# Altium schematic sheet IMU.SchDoc: IMU
size 431 x 279 mm; Date: 02/15/2021; DrawnBy: Team KOIN; Organization: University of Pennsylvania; DocumentNumber: 7; Revision: 2; SheetNumber: 7; SheetTotal: 8
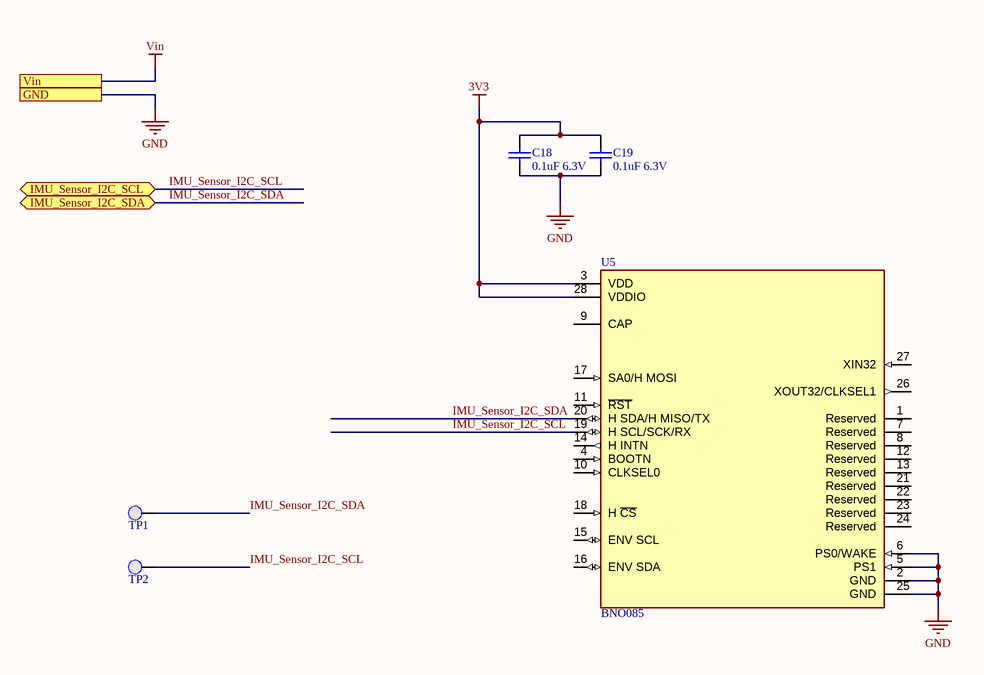
[diagram p0: IMU.SchDoc]

## Parts
C18  0.1uF 6.3V  [CAPC0402(1005)60_M]
C19  0.1uF 6.3V  [CAPC0402(1005)60_M]
TP1  0.1" Pad  [PCBComponent]  (value not drawn)
TP2  0.1" Pad  [PCBComponent]  (value not drawn)
U5  BNO085  [FP-BNO085-MFG]

## Ports
GND, IMU_Sensor_I2C_SCL (bidir), IMU_Sensor_I2C_SDA (bidir), Vin

## Nets
3V3: C18.2 C19.2 U5.3(VDD) U5.28(VDDIO)
GND: C18.1 C19.1 U5.2(GND) U5.5(PS1) U5.6(PS0/WAKE) U5.25(GND) ; port GND
Vin: port Vin
IMU_Sensor_I2C_SCL: TP2.1(PAD) U5.19(H_SCL/SCK/RX) ; port IMU_Sensor_I2C_SCL
IMU_Sensor_I2C_SDA: TP1.1(PAD) U5.20(H_SDA/H_MISO/TX) ; port IMU_Sensor_I2C_SDA

Not connected (* = marked no-connect by the designer): U5 1(Reserved) 4(BOOTN) 7(Reserved) 8(Reserved) 9(CAP) 10(CLKSEL0) 11(~{RST}) 12(Reserved) 13(Reserved) 14(H_INTN) 15(ENV_SCL) 16(ENV_SDA) 17(SA0/H_MOSI) 18(H_~{CS}) 21(Reserved) 22(Reserved) 23(Reserved) 24(Reserved) 26(XOUT32/CLKSEL1) 27(XIN32)

## Notes on the sheet
- DWG. NO.
- REV.
- SHT.
- THIS DOCUMENT AND THE DATA DISCLOSED HEREIN OR HEREWITH IS THE PROPERTY OF ALTIUM LIMITED AND MAY BE FREELY DISTRIBUTED IN WHOLE. NO RIGHTS ARE RESERVED OR EXPRESS OR IMPLIED WARANTEE GIVEN.
- REVISION
- DESCRIPTION
- DATE
- APPROVED
- ENG:
- APPROVALS
- PROJECT
- DSN:
- CHK:
- REFERENCE DOCUMENTS
- PROJECT REVISION:
- TITLE
- DOCUMENT REVISION:
- DESIGN ITEM:
- BOM:
- FAB DWG:
- PCB DWG:
- ASSY DWG:
- SCALE:
- SIZE
- B
- CAGE CODE
- FILE NAME
- DWG NO.
- SHEET
- OF
- REV

## Library data of the parts
C18 C19 = CMP-1034-02060-1: CAP 100nF 6.3V ±5% 0402 (1005 Metric) Thickness 0.6mm SMD; Case-EIA: 0402; Tolerance: Â±5%; Case-Metric: 1005; Rated Voltage: 6.3 V; Max Thickness: 0.6 mm; Value: 100nF; Technology: SMT
TP1 TP2 = 0.1" Pad-A.4
U5 = CMP-197298-000001-1: IMU ACCEL/GYRO/MAG I2C 32BIT; Manufacturer: Hillcrest Laboratories, Inc.; Sensor Type: Accelerometer,Gyroscope,Magnetometer; Max Supply Voltage: 3.6V; Sensor Output: I2C,SPI,UART; Accel Range: 8g; Min Supply Voltage: 1.7V; Temperature Range High: +85°C; ComponentLink2URL: https://www.hillcrestlabs.com/download/5a747b8d566d073a5d000536; Octopart: https://octopart.com/bno085-hillcrest+laboratories-92813482; Height: 1.18mm; Device Class L1: Sensors; Digikey Description: IMU ACCEL/GYRO/MAG I2C 32BIT; Automotive: No; Package: BNO085; Device Class L3: Inertial Measurement Units (IMUs); Temperature: -40°C to +85°C; Category: IC; Device Class L2: Motion Sensors; Lead Free: Yes; Manufacturer Part Number: BNO085; Temperature Range Low: -40°C; RoHS: TRUE; ComponentLink2Description: Datasheet